# EAGLE design kickstart_Adapter_Amiga500_Rev5 (EAGLE 9.6.2)
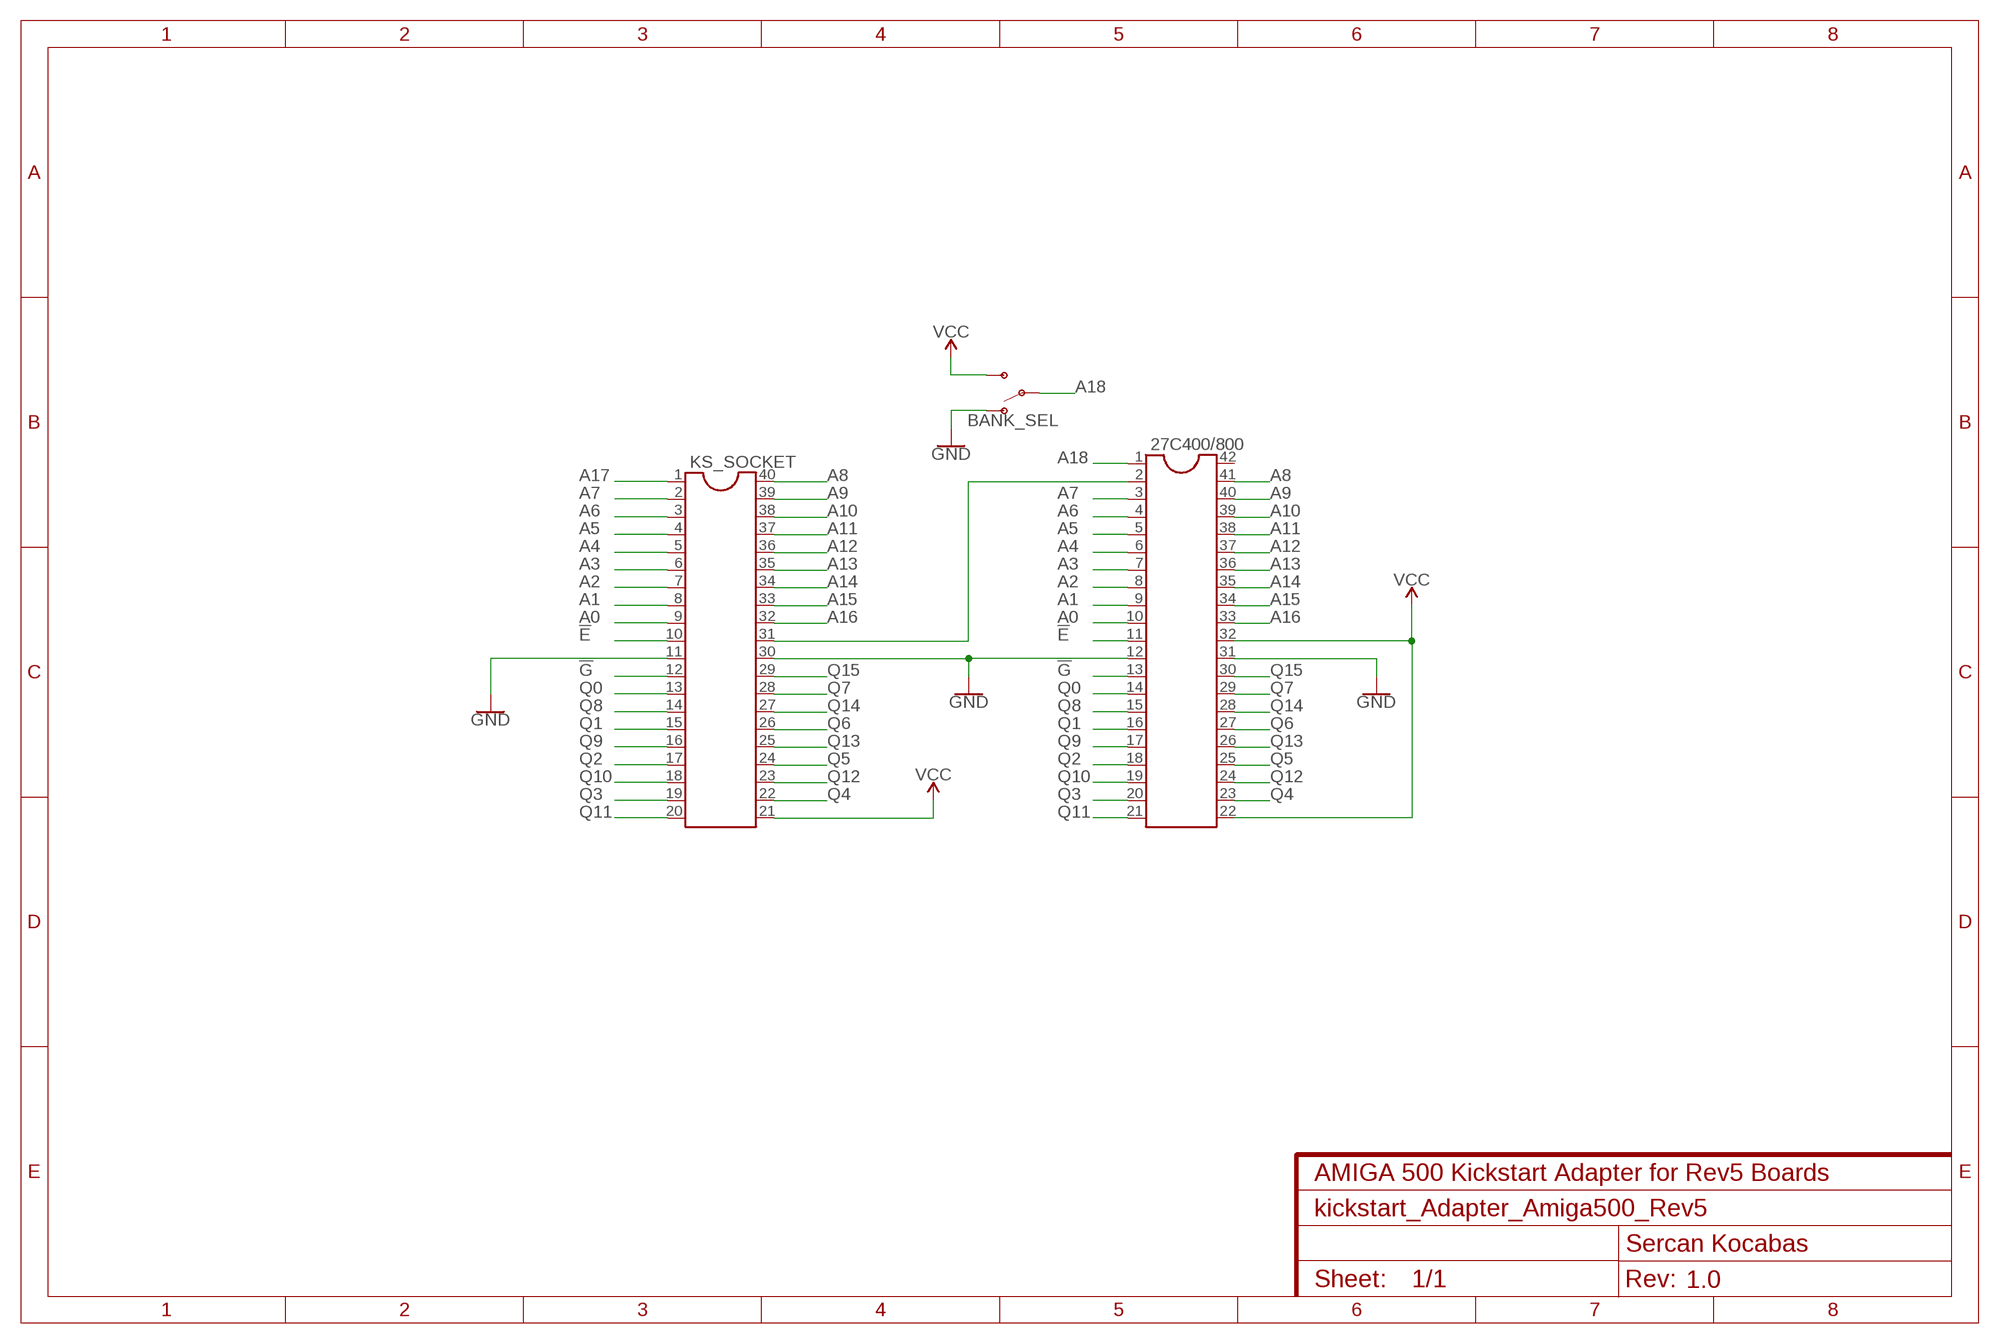
[diagram p0: schematic, sheet 1]
FRAME1 (FRAME-A4L): CNAME: AMIGA 500 Kickstart Adapter for Rev5 Boards; CREVISION: 1.0; DESIGNER: Sercan Kocabas

## Parts
27C400/800  DIL42  [DIL42]
BANK_SEL  SWITCH-SPDT-PTH-11.6X4.0MM  [SWITCH_SPDT_PTH_11.6X4.0MM]
KS_SOCKET  DIL40  [DIL40]

## Nets
!E: 27C400/800.11 KS_SOCKET.10
!G: 27C400/800.13 KS_SOCKET.12
A0: 27C400/800.10 KS_SOCKET.9
A1: 27C400/800.9 KS_SOCKET.8
A2: 27C400/800.8 KS_SOCKET.7
A3: 27C400/800.7 KS_SOCKET.6
A4: 27C400/800.6 KS_SOCKET.5
A5: 27C400/800.5 KS_SOCKET.4
A6: 27C400/800.4 KS_SOCKET.3
A7: 27C400/800.3 KS_SOCKET.2
A8: 27C400/800.41 KS_SOCKET.40
A9: 27C400/800.40 KS_SOCKET.39
A10: 27C400/800.39 KS_SOCKET.38
A11: 27C400/800.38 KS_SOCKET.37
A12: 27C400/800.37 KS_SOCKET.36
A13: 27C400/800.36 KS_SOCKET.35
A14: 27C400/800.35 KS_SOCKET.34
A15: 27C400/800.34 KS_SOCKET.33
A16: 27C400/800.33 KS_SOCKET.32
A17: 27C400/800.2 KS_SOCKET.1 KS_SOCKET.31
A18: 27C400/800.1 BANK_SEL.2(P)
GND: 27C400/800.12 27C400/800.31 BANK_SEL.1(O) KS_SOCKET.11 KS_SOCKET.30
Q0: 27C400/800.14 KS_SOCKET.13
Q1: 27C400/800.16 KS_SOCKET.15
Q2: 27C400/800.18 KS_SOCKET.17
Q3: 27C400/800.20 KS_SOCKET.19
Q4: 27C400/800.23 KS_SOCKET.22
Q5: 27C400/800.25 KS_SOCKET.24
Q6: 27C400/800.27 KS_SOCKET.26
Q7: 27C400/800.29 KS_SOCKET.28
Q8: 27C400/800.15 KS_SOCKET.14
Q9: 27C400/800.17 KS_SOCKET.16
Q10: 27C400/800.19 KS_SOCKET.18
Q11: 27C400/800.21 KS_SOCKET.20
Q12: 27C400/800.24 KS_SOCKET.23
Q13: 27C400/800.26 KS_SOCKET.25
Q14: 27C400/800.28 KS_SOCKET.27
Q15: 27C400/800.30 KS_SOCKET.29
VCC: 27C400/800.22 27C400/800.32 BANK_SEL.3(S) KS_SOCKET.21
Unconnected: 27C400/800.42

## Library data of the parts
27C400/800 = ic-package:DIL42: Dual In Line
BANK_SEL = SparkFun-Switches:SWITCH-SPDT: Single Pole, Double Throw (SPDT) Switch Single-pole, double-throw (SPDT) switch. Variant Overview SMD-AYZ0202 Surface Mount DPDT Switch <https://www.sparkfun.com/products/597> (COM-00597) Used on e.g. LilyPad Arduino USB - ATmega32U4 Board <https://www.sparkfun.com/products/12049> PTH-11.6X4.0MM SPDT Mini Power Switch <https://www.sparkfun.com/products/102> (COM-00102) Used on e.g. SparkFun Simon Says - Through-Hole Soldering Kit <https://www.sparkfun.com/products/10547> (KIT-10547) PTH-11.6X4.0MM-KIT KIT version of SPDT Mini Power Switch - Simplifies soldering by removing tStop of switch pins - only one side can be soldered. PTH-11.6X4.0MM-LOCK LOCK version of SPDT Mini Power Switch - Offset pins hold switch in place for easier soldering. SMD-RIGHT-ANGLE Surface Mount Right Angle Switch <https://www.sparkfun.com/products/10860> (COM-10860) Used on e.g. SparkFun ESP8266 Thing <https://www.sparkfun.com/products/13231>; PROD_ID: SWCH-08261; SF_SKU: COM-00102
KS_SOCKET = ic-package:DIL40: Dual In Line

## Board
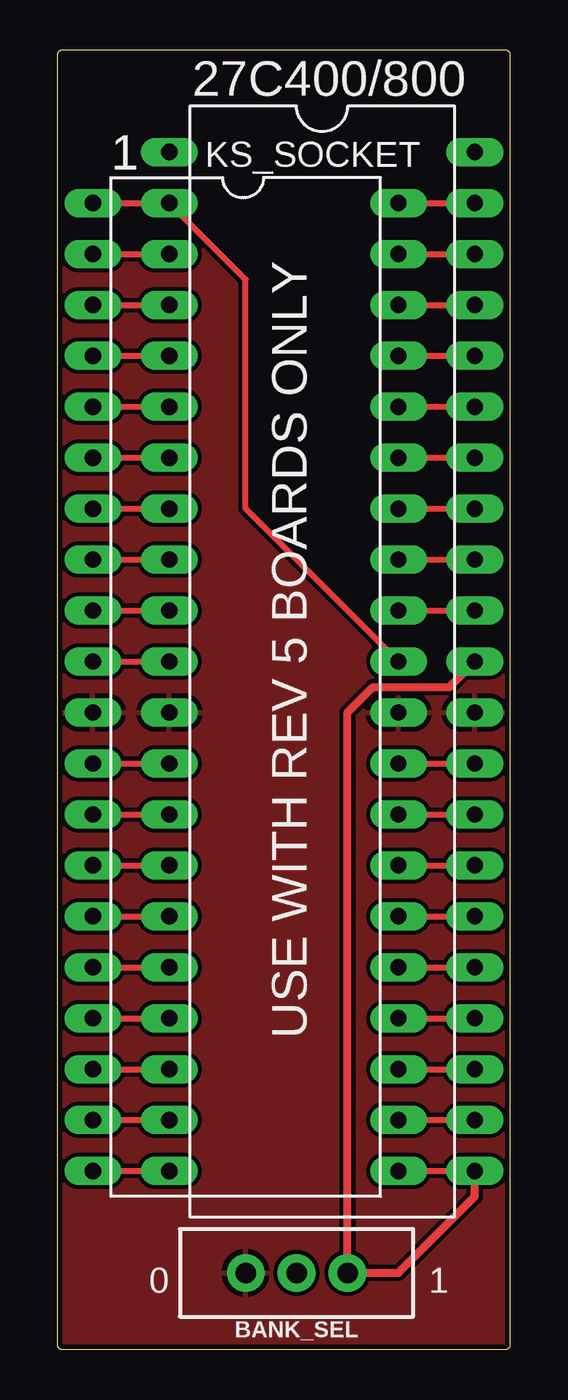
[diagram p1: board, top side]
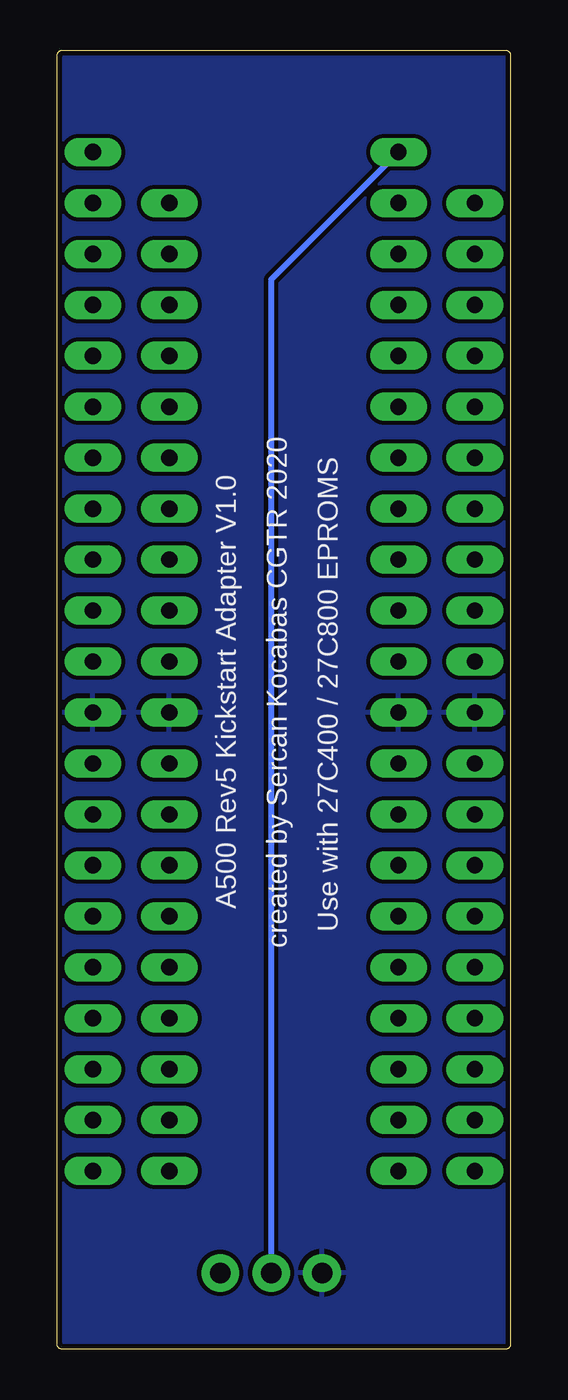
[diagram p2: board, bottom side, seen from below]

Size 22.61 x 64.77 mm. Coordinates in mm from the lower left corner, seen from the top.
Outline: 0.25,0 22.35,0 arc90 22.61,0.25 22.61,64.51 arc90 22.35,64.77 0.25,64.77 arc90 0,64.52 0,0.25 arc90 0.25,0
Copper layers (1*16): Top 0.035mm / dielectric 1.5mm / Bottom 0.035mm
Design rules "SparkFun": minimum track width 8mil, minimum drill 20mil, track to track 8mil, track to pad 8mil, pad to pad 8mil, via to via 8mil, smd to smd 8mil, copper to edge 10mil, drill to drill 8mil, minimum pad ring 12mil, minimum via ring 10mil, stop-mask expansion 4mil, vias tented up to drill 25mil, thermal gap 10mil

### Footprints (pad centres in the part's own frame; a part is rotated, then mirrored left to right if it is on the bottom)
DIL42 = drill 0.813 long: 1 -25.4,-7.62; 2 -22.86,-7.62; 3 -20.32,-7.62; 4 -17.78,-7.62; 5 -15.24,-7.62; 6 -12.7,-7.62; 7 -10.16,-7.62; 8 -7.62,-7.62; 9 -5.08,-7.62; 10 -2.54,-7.62; 11 0,-7.62; 12 2.54,-7.62; 13 5.08,-7.62; 14 7.62,-7.62; 15 10.16,-7.62; 16 12.7,-7.62; 17 15.24,-7.62; 18 17.78,-7.62; 19 20.32,-7.62; 20 22.86,-7.62; 21 25.4,-7.62; 22 25.4,7.62; 23 22.86,7.62; 24 20.32,7.62; 25 17.78,7.62; 26 15.24,7.62; 27 12.7,7.62; 28 10.16,7.62; 29 7.62,7.62; 30 5.08,7.62; 31 2.54,7.62; 32 0,7.62; 33 -2.54,7.62; 34 -5.08,7.62; 35 -7.62,7.62; 36 -10.16,7.62; 37 -12.7,7.62; 38 -15.24,7.62; 39 -17.78,7.62; 40 -20.32,7.62; 41 -22.86,7.62; 42 -25.4,7.62
SWITCH_SPDT_PTH_11.6X4.0MM = drill 1.016 pad 1.88: 1 0,2.54; 2 0,0; 3 0,-2.54
DIL40 = drill 0.813 long: 1 -24.13,-7.62; 2 -21.59,-7.62; 3 -19.05,-7.62; 4 -16.51,-7.62; 5 -13.97,-7.62; 6 -11.43,-7.62; 7 -8.89,-7.62; 8 -6.35,-7.62; 9 -3.81,-7.62; 10 -1.27,-7.62; 11 1.27,-7.62; 12 3.81,-7.62; 13 6.35,-7.62; 14 8.89,-7.62; 15 11.43,-7.62; 16 13.97,-7.62; 17 16.51,-7.62; 18 19.05,-7.62; 19 21.59,-7.62; 20 24.13,-7.62; 21 24.13,7.62; 22 21.59,7.62; 23 19.05,7.62; 24 16.51,7.62; 25 13.97,7.62; 26 11.43,7.62; 27 8.89,7.62; 28 6.35,7.62; 29 3.81,7.62; 30 1.27,7.62; 31 -1.27,7.62; 32 -3.81,7.62; 33 -6.35,7.62; 34 -8.89,7.62; 35 -11.43,7.62; 36 -13.97,7.62; 37 -16.51,7.62; 38 -19.05,7.62; 39 -21.59,7.62; 40 -24.13,7.62

### Placement (x,y rotation side)
27C400/800  13.21,34.29 270 top
BANK_SEL  11.94,3.81 90 top
KS_SOCKET  9.4,33.02 270 top

### Tracks (layer width: path | path; a pad name or v marks a point on that pad's centre or on a via)
!E
  Top 0.305: KS_SOCKET.10 27C400/800.11
!G
  Top 0.305: KS_SOCKET.12 27C400/800.13
A0
  Top 0.305: KS_SOCKET.9 27C400/800.10
A1
  Top 0.305: KS_SOCKET.8 27C400/800.9
A2
  Top 0.305: KS_SOCKET.7 27C400/800.8
A3
  Top 0.305: KS_SOCKET.6 27C400/800.7
A4
  Top 0.305: KS_SOCKET.5 27C400/800.6
A5
  Top 0.305: KS_SOCKET.4 27C400/800.5
A6
  Top 0.305: KS_SOCKET.3 27C400/800.4
A7
  Top 0.305: KS_SOCKET.2 27C400/800.3
A8
  Top 0.305: KS_SOCKET.40 27C400/800.41
A9
  Top 0.305: KS_SOCKET.39 27C400/800.40
A10
  Top 0.305: KS_SOCKET.38 27C400/800.39
A11
  Top 0.305: KS_SOCKET.37 27C400/800.38
A12
  Top 0.305: KS_SOCKET.36 27C400/800.37
A13
  Top 0.305: KS_SOCKET.35 27C400/800.36
A14
  Top 0.305: KS_SOCKET.34 27C400/800.35
A15
  Top 0.305: KS_SOCKET.33 27C400/800.34
A16
  Top 0.305: KS_SOCKET.32 27C400/800.33
A17
  Top 0.305: KS_SOCKET.1 27C400/800.2 9.4,53.34 9.4,41.91 KS_SOCKET.31
A18
  Bottom 0.305: 27C400/800.1 11.94,53.34 BANK_SEL.2
GND
  pour Top: -2.03,-1.27 -2.03,66.04 24.64,66.04 24.64,-1.27
  pour Bottom: -3.3,67.31 25.91,67.31 25.91,-2.54 -3.3,-2.54
Q0
  Top 0.305: KS_SOCKET.13 27C400/800.14
Q1
  Top 0.305: KS_SOCKET.15 27C400/800.16
Q2
  Top 0.305: KS_SOCKET.17 27C400/800.18
Q3
  Top 0.305: KS_SOCKET.19 27C400/800.20
Q4
  Top 0.305: KS_SOCKET.22 27C400/800.23
Q5
  Top 0.305: KS_SOCKET.24 27C400/800.25
Q6
  Top 0.305: KS_SOCKET.26 27C400/800.27
Q7
  Top 0.305: KS_SOCKET.28 27C400/800.29
Q8
  Top 0.305: KS_SOCKET.14 27C400/800.15
Q9
  Top 0.305: KS_SOCKET.16 27C400/800.17
Q10
  Top 0.305: KS_SOCKET.18 27C400/800.19
Q11
  Top 0.305: KS_SOCKET.20 27C400/800.21
Q12
  Top 0.305: KS_SOCKET.23 27C400/800.24
Q13
  Top 0.305: KS_SOCKET.25 27C400/800.26
Q14
  Top 0.305: KS_SOCKET.27 27C400/800.28
Q15
  Top 0.305: KS_SOCKET.29 27C400/800.30
VCC
  Top 0.305: KS_SOCKET.21 27C400/800.22
  Top 0.406: 27C400/800.22 20.83,7.62 17.02,3.81 BANK_SEL.3 14.48,31.75 15.75,33.02 19.56,33.02 27C400/800.32

### Text on the board
tPlace: 1 | USE WITH REV 5 BOARDS ONLY | 0 | 1
bPlace: created by Sercan Kocabas CGTR 2020 | Use with 27C400 / 27C800 EPROMS | A500 Rev5 Kickstart Adapter V1.0